# Altium schematic sheet Alignment_driver.SchDoc: Alignment Laser
size A4; Author: Won Chen; SheetNumber: 7; SheetTotal: 9; SPICEModelCacheKWXMVFZK: <root> / <DocumentId>KWXMVFZK</DocumentId> / <CacheFrame Number="0"> / <Model Name="si2302cds" Kind="CKT"> / <Text>*August 11, 2008 / *Doc. ID: 68508, S-81826, Rev. A / *File Name: Si2302CDS_PS.txt and Si2302CDS_PS.lib / *This document is intended as a SPICE modeling guideline and does not / *constitute a commercial product data sheet.  Designers should refer to the / *appropriate data sheet of the same number for guaranteed specification / *limits. / .SUBCKT Si2302CDS D G S / M1  3  GX S S NMOS W=273327u L=0.250u / M2  S  GX S D PMOS W=273327u L=0.235u / RG  G  GX     4 / R1  D  3      RTEMP 18E-3 / CGS GX S      201E-12 / DBD S  D      DBD / *********************************************************** / .MODEL  NMOS       NMOS ( LEVEL  = 3        TOX    = 1.7E-8 / + RS     = 18E-3          RD     = 0        NSUB   = 2.45E17 / + KP     = 2.8E-5         UO     = 650 / + VMAX   = 0              XJ     = 5E-7     KAPPA  = 3E-2 / + ETA    = 1E-4           TPG    = 1 / + IS     = 0              LD     = 0 / + CGSO   = 0              CGDO   = 0        CGBO   = 0 / + NFS    = 0.8E12         DELTA  = 0.1) / ************************************************************ / .MODEL  PMOS       PMOS ( LEVEL  = 3        TOX    = 1.7E-8 / +NSUB    = 2E17           IS     = 0        TPG    = -1) / ************************************************************ / .MODEL DBD D (CJO=60E-12 VJ=0.38 M=0.26 / +FC=0.5 TT=4.71E-8 T_MEASURED=25 BV=21 / +RS=4.856e-02 N=1.214 IS=5.289e-09 IKF=1000 / +EG=5.600e-01 XTI=8.258 TRS1=2.944e-12) / ************************************************************ / .MODEL RTEMP RES (TC1=8E-3 TC2=5.5E-6) / ************************************************************ / .ENDS</Text> / </Model> / <Model Name="ao3401" Kind="MDL"> / <Text>.model AO3401 VDMOS Rg=7.8 Rd=0m Rs=0.2m Vto=-1.2 Kp=17 Cgdmax=400p Cgdmin=80p Cgs=645p Cjo=147p Is=10p Rb=0.2m Pchan mfg=Alpha_&amp;_Omega ksubthres=.1</Text> / </Model> / </CacheFrame> / </root>
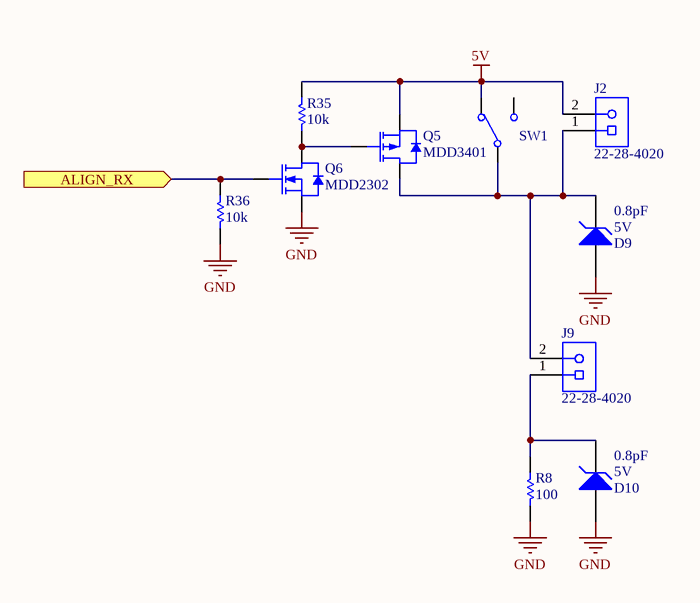
[diagram p0: Alignment_driver.SchDoc]

## Parts
D9  value 5V  Capacitance: 0.8pF  [DFN60P100X45-2L]  (hidden comment: H5VU10U)
D10  value 5V  Capacitance: 0.8pF  [DFN60P100X45-2L]  (hidden comment: H5VU10U)
J2  22-28-4020  [22-28-4020-Footprint-1]
J9  22-28-4020  [22-28-4020-Footprint-1]
Q5  MDD3401  [SOT95P252X140-3N]
Q6  MDD2302  [SOT95P252X140-3N]
R8  value 100  [RESC1005X04N]  (hidden comment: 0402WGF1000TCE)
R35  value 10k  [RESC1005X04N]  (hidden comment: CRCW0402-10K0FKED)
R36  value 10k  [RESC1005X04N]  (hidden comment: CRCW0402-10K0FKED)
SW1  PCM12SMTR  [PCM12SMTR-Footprint-1]  (value not drawn)

## Ports
ALIGN_RX (in)

## Nets
5V: J2.2 Q5.2(S) R35.2 SW1.3
GND: D9.2(A) D10.2(A) Q6.2(S) R8.1 R36.1
ALIGN_RX: Q6.1(G) R36.2 ; port ALIGN_RX
NetD9_1: D9.1(K) J2.1 J9.2 Q5.3(D) SW1.2
NetD10_1: D10.1(K) J9.1 R8.2
NetQ5_1: Q5.1(G) Q6.3(D) R35.1

Not connected (* = marked no-connect by the designer): SW1 1

## Notes on the sheet
- Title:
- Designer:
- Date:
- Size:
- Revision:
- A4
- Sheet:
- 35 Stirling Hwy, Perth WA 6009, Australia

## Library data of the parts
D9 D10 = CMP-00841-4: 5A 55W 16V 9V Unidirectional 5V DFN1006-2L  ESD and Surge Protection (TVS/ESD) ROHS; Breakdown Voltage: 9V; Source: JLCPCB(Basic); JLC_PN: C22395519; Polarity: Unidirectional; RoHS Compliant: Unsure; Package: DFN1006-2L; Peak Pulse Power Dissipation: 55W; Clamping Voltage: 16V
J2 J9 = CMP-00157-5: KK 254 Breakaway Header, Vertical, 2 Circuits, Tin (Sn) Plating, Mating Pin Length 6.09mm 2 POS; Connector Type: Male Pin; Current Rating: 4A; Pitch: 2.54mm; Contact Resistance: 20m; Gender: Male; Voltage Rating: 250V; Number of Contacts: 2; Mounting Technology: Through Hole; Depth: 2.49mm; Termination: Solder; Max Operating Temperature: 75°C; Number of Rows: 1; Contact Plating: Tin; Contact Material: Brass,Bronze; Min Operating Temperature: 0°C; Housing Color: Black; Housing Material: Nylon; Orientation: Straight; RoHS Compliant: Unsure; Source: Aliexpress
Q5 = CMP-00682-5: 30V 4.2A 45mΩ@10V P Channel SOT-23 MOSFETs ROHS; Input Capacitance: 655pF; Rds On Max: 57m; Drain to Source Voltage (Vdss): -30V; Max Power Dissipation: 1.2W; Gate to Source Voltage (Vgs): 12V; Threshold Voltage: -1.2V; Continuous Drain Current (ID): 4.2A; Case/Package: SOT-23; JLC_PN: C427383; Type: P Channel; RoHS Compliant: Unsure; Source: JLCPCB(Extended,Economic_PCBA)
Q6 = CMP-00703-4: 4A 25mΩ@4.5V null SOT-23 MOSFETs ROHS N CHANNEL; Max Power Dissipation: 1.25W; Input Capacitance: 340pF; Gate to Source Voltage (Vgs): 12V; Drain to Source Voltage (Vdss): 20V; Threshold Voltage: 1.2V; Rds On Max: 28m; RoHS Compliant: Unsure; Source: JLCPCB(Basic); Type: N channel; JLC_PN: C427390; Continuous Drain Current (ID): 4A; Case/Package: SOT-23
R8 = CMP-00655-3: Fixed Resistor, Metal Glaze/thick Film, 0.0625W, 100ohm, 50V, 1% +/-Tol, 100ppm/Cel, Surface Mount, 0402; RoHS Compliant: Yes; JLC_PN: C25076; Tolerance: 1%; Source: JLCPCB(Basic); Case Code (Imperial): 0402
R35 R36 = CMP-00515-7: Res Thick Film 0402 10K Ohm 1% 1/16W ±100ppm/°C Molded SMD Paper T/R; Power Rating: 63mW; Voltage Rating: 50V; Source: JLCPCB(Basic); JLC_PN: C25744; Tolerance: 1%; Temperature Coefficient: 100ppm/°C; Case Code (Imperial): 0402; RoHS Compliant: Unsure
SW1 = CMP-00120-3: C & K COMPONENTS - PCM12SMTR - SWITCH, SPDT, 0.3A, 6VDC, SMD; Voltage Rating (DC): 6V; Max Current Rating: 300mA; Actuator Type: Standard; Switch Function: On-On; Switch Travel: 1.5mm; Insulation Resistance: 100mR; Mechanical Life: 10000Cycles; Contact Resistance: 70mR; Actuator Material: Nylon,Polyamide; Length: 7.7mm; Contact Plating: Silver; Current Rating: 300mA; Min Operating Temperature: -20°C; Contact Current Rating: 300mA; Max Voltage Rating (DC): 6V; Max Operating Temperature: 85°C; Termination: Gull Wing; Package Quantity: 1; Width: 6.7mm; Orientation: Right Angle; Voltage Rating (AC): 6V; Lead Free: Lead Free; Mount: Surface Mount; Actuator Length: 1.5mm; Packaging: Tape and Reel; Contact Material: Copper Alloy,Copper,Silver; Throw Configuration: SPDT; REACH SVHC: No SVHC; Depth: 5mm; Source: Distributor